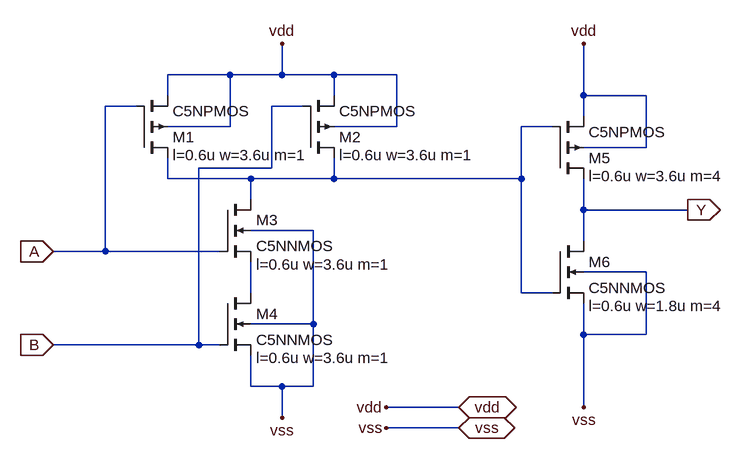
[diagram p0: schematic and2_4x.asc]
and2_4x.asc, the LTspice schematic file:
Version 4
SHEET 1 880 680
WIRE -336 -64 -432 -64
WIRE -256 -64 -256 -112
WIRE -256 -64 -336 -64
WIRE -176 -64 -256 -64
WIRE -80 -64 -176 -64
WIRE -432 -32 -432 -64
WIRE -176 -32 -176 -64
WIRE 208 -32 208 -112
WIRE 304 -32 208 -32
WIRE -480 -16 -528 -16
WIRE -224 -16 -272 -16
WIRE 208 0 208 -32
WIRE -336 16 -336 -64
WIRE -336 16 -432 16
WIRE -80 16 -80 -64
WIRE -80 16 -176 16
WIRE 160 16 112 16
WIRE 304 48 304 -32
WIRE 304 48 208 48
WIRE -272 80 -272 -16
WIRE -272 80 -384 80
WIRE -432 96 -432 64
WIRE -304 96 -432 96
WIRE -176 96 -176 64
WIRE -176 96 -304 96
WIRE 112 96 112 16
WIRE 112 96 -176 96
WIRE -304 128 -304 96
WIRE 208 144 208 96
WIRE 368 144 208 144
WIRE -208 176 -304 176
WIRE 208 192 208 144
WIRE -528 208 -528 -16
WIRE -528 208 -608 208
WIRE -352 208 -528 208
WIRE 304 240 208 240
WIRE -304 272 -304 224
WIRE 112 272 112 96
WIRE 160 272 112 272
WIRE -208 320 -208 176
WIRE -208 320 -304 320
WIRE 208 336 208 288
WIRE 304 336 304 240
WIRE 304 336 208 336
WIRE -384 352 -384 80
WIRE -384 352 -608 352
WIRE -352 352 -384 352
WIRE -304 416 -304 368
WIRE -256 416 -304 416
WIRE -208 416 -208 320
WIRE -208 416 -256 416
WIRE 16 448 -96 448
WIRE 208 448 208 336
WIRE -256 464 -256 416
WIRE 16 480 -96 480
FLAG -608 208 A
IOPIN -608 208 In
FLAG 368 144 Y
IOPIN 368 144 Out
FLAG 208 -112 vdd
FLAG 208 448 vss
FLAG -608 352 B
IOPIN -608 352 In
FLAG 16 448 vdd
IOPIN 16 448 BiDir
FLAG 16 480 vss
IOPIN 16 480 BiDir
FLAG -96 448 vdd
FLAG -96 480 vss
FLAG -256 -112 vdd
FLAG -256 464 vss
SYMBOL nmos4 160 192 R0
WINDOW 123 56 100 Left 2
SYMATTR Value2 l=0.6u w=1.8u m=4
SYMATTR InstName M6
SYMATTR Value C5NNMOS
SYMBOL pmos4 160 96 M180
WINDOW 123 56 4 Left 2
SYMATTR Value2 l=0.6u w=3.6u m=4
SYMATTR InstName M5
SYMATTR Value C5NPMOS
SYMBOL pmos4 -480 64 M180
WINDOW 123 56 4 Left 2
SYMATTR Value2 l=0.6u w=3.6u m=1
SYMATTR InstName M1
SYMATTR Value C5NPMOS
SYMBOL pmos4 -224 64 M180
WINDOW 123 56 4 Left 2
SYMATTR Value2 l=0.6u w=3.6u m=1
SYMATTR InstName M2
SYMATTR Value C5NPMOS
SYMBOL nmos4 -352 128 R0
WINDOW 123 56 100 Left 2
SYMATTR Value2 l=0.6u w=3.6u m=1
SYMATTR InstName M3
SYMATTR Value C5NNMOS
SYMBOL nmos4 -352 272 R0
WINDOW 123 56 100 Left 2
SYMATTR Value2 l=0.6u w=3.6u m=1
SYMATTR InstName M4
SYMATTR Value C5NNMOS

The netlist it stands for:
* and2_4x.asc
M6 Y N001 vss vss C5NNMOS l=0.6u w=1.8u m=4
M5 Y N001 vdd vdd C5NPMOS l=0.6u w=3.6u m=4
M1 N001 A vdd vdd C5NPMOS l=0.6u w=3.6u m=1
M2 N001 B vdd vdd C5NPMOS l=0.6u w=3.6u m=1
M3 N001 A N002 vss C5NNMOS l=0.6u w=3.6u m=1
M4 N002 B vss vss C5NNMOS l=0.6u w=3.6u m=1
.model NMOS NMOS
.model PMOS PMOS
.lib standard.mos
.backanno
.end